# EAGLE design DigitalIO_3_3V_LevelShift (EAGLE 7.7.0)
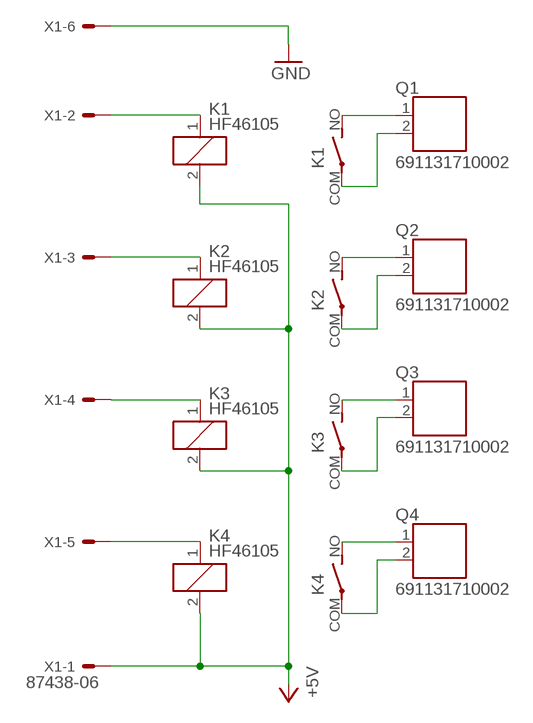
[diagram p0: schematic, sheet 1]

## Parts
K1  HF46105  [HF46]
K2  HF46105  [HF46]
K3  HF46105  [HF46]
K4  HF46105  [HF46]
Q1  691131710002  [691131710002]
Q2  691131710002  [691131710002]
Q3  691131710002  [691131710002]
Q4  691131710002  [691131710002]
X1  87438-06  [87438-06]

## Nets
+5V: K1.2 K2.2 K3.2 K4.2 X1.1
GND: X1.6
N$2: K2.1 X1.3
N$4: K4.1 X1.5
N$5: K1.1 X1.2
N$6: K1.NO(2:S) Q1.1
N$7: K1.COM(2:P) Q1.2
N$8: K2.NO(2:S) Q2.1
N$9: K2.COM(2:P) Q2.2
N$10: K3.NO(2:S) Q3.1
N$11: K3.COM(2:P) Q3.2
N$12: K4.NO(2:S) Q4.1
N$13: K4.COM(2:P) Q4.2
N$14: K3.1 X1.4

## Library data of the parts
K1-K4 = hongfa:HF46?*: Slim Power Relay NAiS Source: http://www.hongfa.com/pro/pdf/HF46F_en.pdf; OC_FARNELL: unknown; OC_NEWARK: unknown
Q1-Q4 = con-wuerth:691131710002: WR-TBL Terminal block - CUU5/2 CUU5/2GR - 2 Pins;=>Code : Con_TBL_Screw_PClamp_5.00_6911317100xx_691131710002 <http://katalog.we-online.de/media/images/eican/Con_TBL_Screw_PClamp_5.00_6911317100xx_pf2.jpg> Details see: http://katalog.we-online.de/em/datasheet/6911317100xx.pdf Created 11/23/2014, Karrer Zheng 2014 (C) Wurth Elektronik
X1 = con-molex:87438-06: Wire-to-Board 1.50mm (.059") Pitch Header - Right Angle, SMT, Shrouded Source: http://www.molex.com/product/micro/87438.html; MPN: 87438-0643; OC_FARNELL: 1756938; OC_NEWARK: 88K3155

## Board
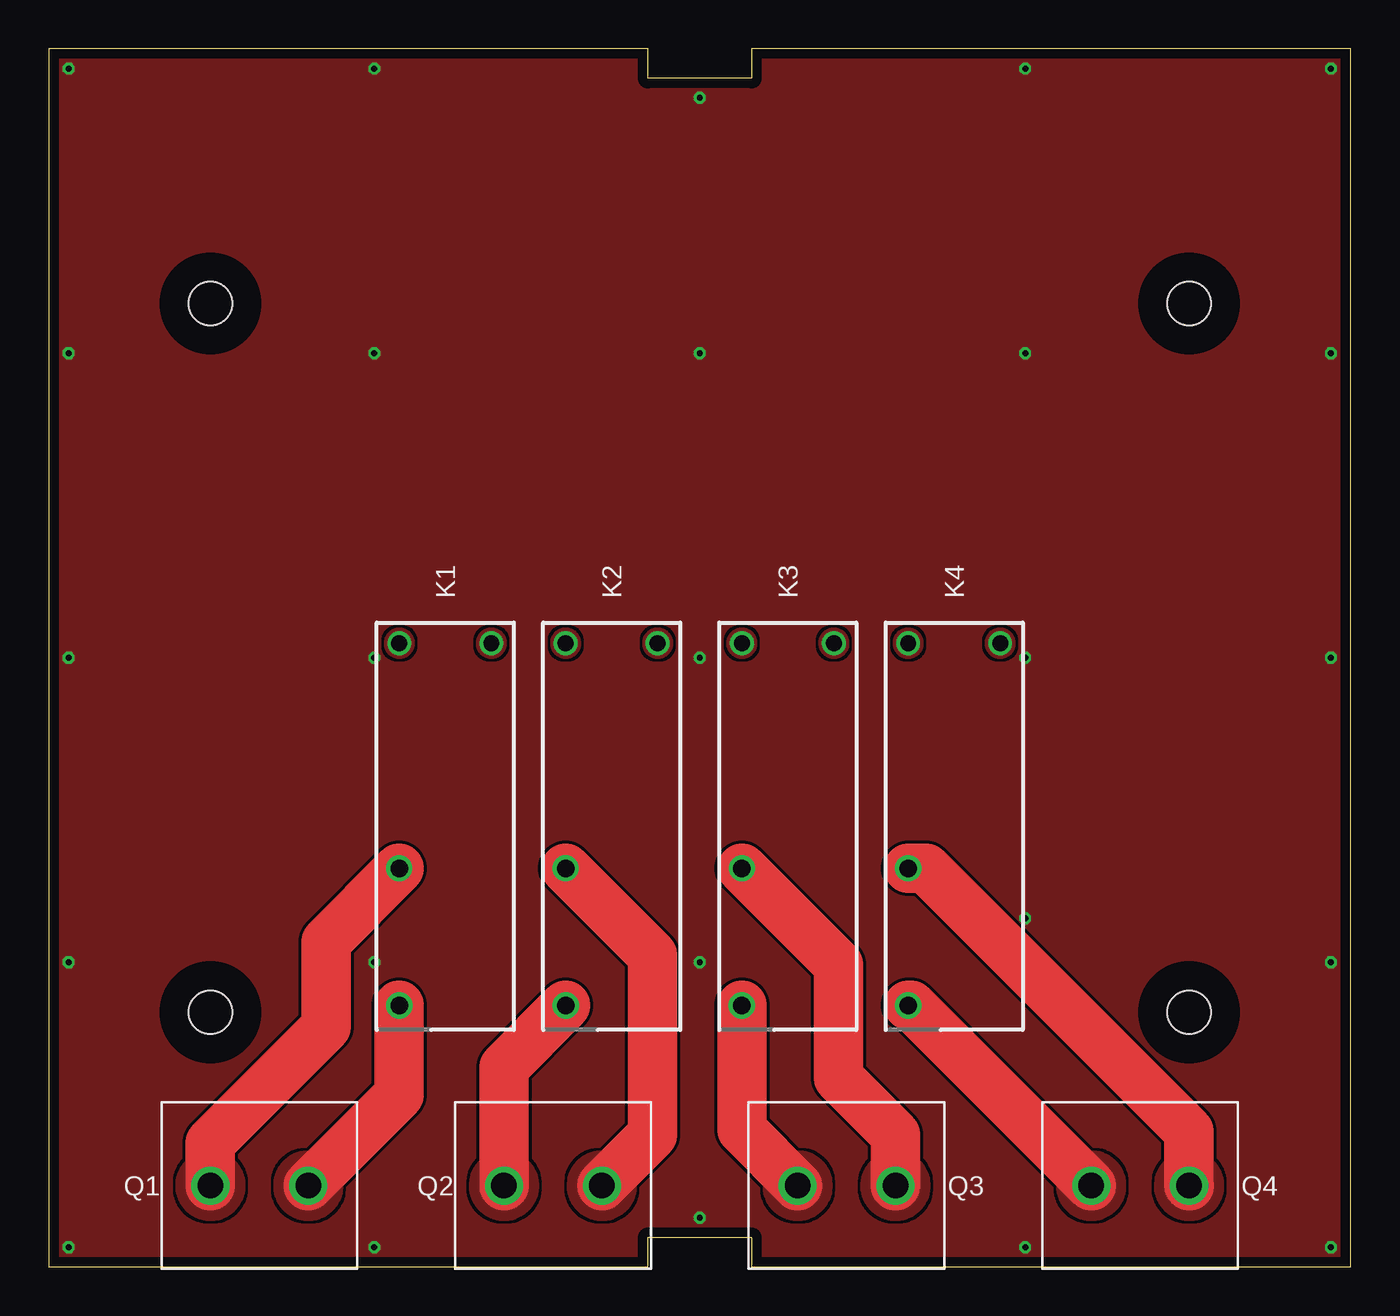
[diagram p1: board, top side]
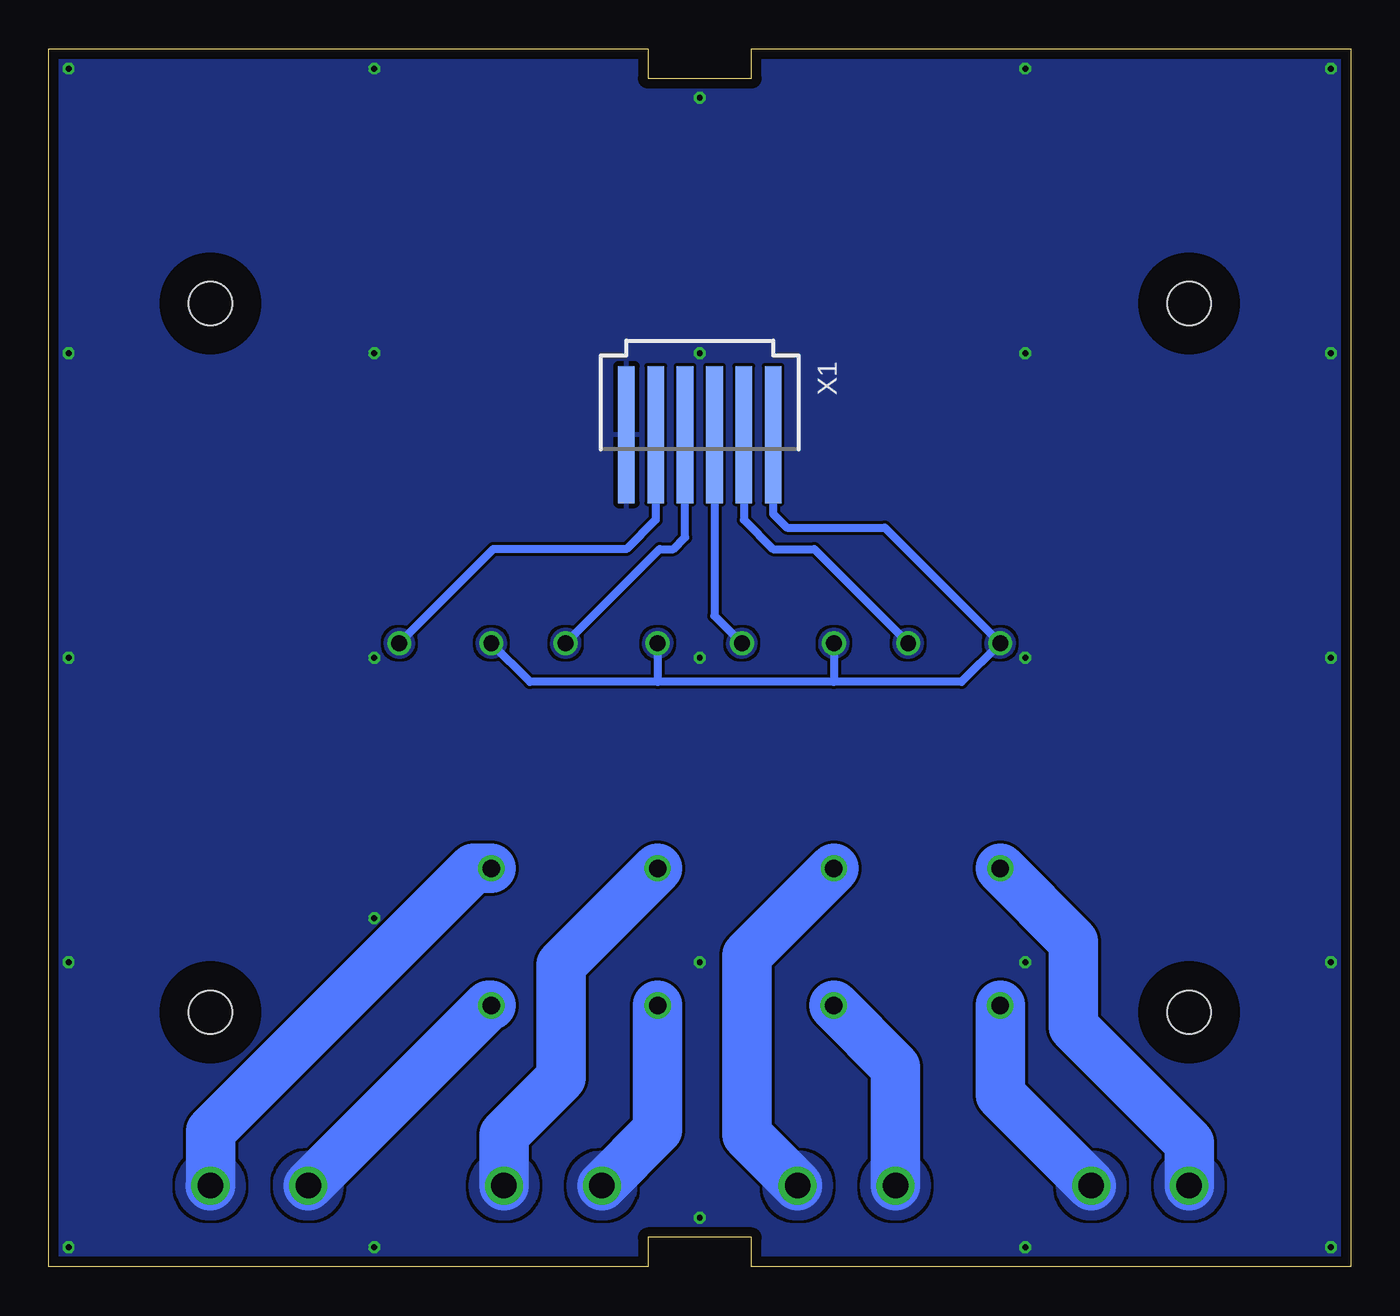
[diagram p2: board, bottom side, seen from below]

Size 66.5 x 62.2 mm. Coordinates in mm from the lower left corner, seen from the top.
Outline: 0,0 30.6,0 30.6,1.5 35.9,1.5 35.9,0 66.5,0 66.5,62.2 35.9,62.2 35.9,60.7 30.6,60.7 30.6,62.2 0,62.2 0,0
Copper layers (1*16): Top 0.035mm / dielectric 1.6mm / Bottom 0.035mm
Design rules "Elecrow *": minimum track width 6mil, minimum drill 12mil, track to track 6mil, track to pad 6mil, pad to pad 6mil, via to via 8mil, smd to smd 0mil, copper to edge 20mil, drill to drill 10mil, minimum pad ring 6mil, minimum via ring 6mil, stop-mask expansion 0mil, vias tented up to drill 100mil, thermal gap 10mil
Holes 2.2 mm at 8.25,49.2 58.25,13 8.25,13 58.25,49.2
tRestrict: area 5.7,10.4 to 10.8,15.6; area 55.6,10.4 to 60.9,15.6; area 55.6,46.6 to 60.9,51.8; area 5.7,46.6 to 10.8,51.8
bRestrict: area 5.7,10.4 to 10.8,15.6; area 55.6,10.4 to 60.9,15.6; area 55.6,46.6 to 60.9,51.8; area 5.7,46.6 to 10.8,51.8

### Footprints (pad centres in the part's own frame; a part is rotated, then mirrored left to right if it is on the bottom)
HF46 = drill 0.813: 1 -9.35,2.35; 2 -9.35,-2.35 | drill 0.889: COM 2.15,-2.35 | drill 0.9: NO 9.15,-2.35
691131710002 = drill 1.3: 1 -2.5,0; 2 2.5,0
87438-06 = smd 7 x 0.85: 1 0,3.75; 2 0,2.25; 3 0,0.75; 4 0,-0.75; 5 0,-2.25; 6 0,-3.75

### Placement (x,y rotation side)
K1  20.25,22.5 270 top
K2  28.75,22.5 270 top
K3  37.75,22.5 270 top
K4  46.25,22.5 270 top
Q1  10.75,4.15 180 top
Q2  25.75,4.15 0 top
Q3  40.75,4.15 0 top
Q4  55.75,4.15 0 top
X1  33.25,42.5 270 bottom

### Tracks (layer width: path | path; a pad name or v marks a point on that pad's centre or on a via)
+5V
  Bottom 0.406: 26.4,29.88 19.87,29.88 K1.2 23.8,37.75 28.8,37.75 29.5,38.45 X1.1 | 26.4,29.88 35.4,29.88 | 35.4,29.88 41.93,29.88 K4.2 | K3.2 35.4,29.88 | K2.2 26.4,29.88
  pour Bottom (no thermals): 18.38,31.38 arc180 17.42,32.32 arc180
  pour Top (no thermals): 18.38,31.38 arc180 17.42,32.32 arc180
  pour Top (no thermals): 26.88,31.38 arc180 25.92,32.32 arc180
  pour Bottom (no thermals): 26.88,31.38 arc180 25.92,32.32 arc180
  pour Bottom (no thermals): 35.88,31.38 arc180 34.92,32.32 arc180
  pour Top (no thermals): 35.88,31.38 arc180 34.92,32.32 arc180
  pour Top (no thermals): 44.38,32.32 arc180 43.42,31.38 arc180
  pour Bottom (no thermals): 44.38,32.32 arc180 43.42,31.38 arc180
GND  (via drill 0.3)
  other vias: 1,1 1,61.2 1,46.65 1,31.1 1,15.55 16.62,61.2 16.62,46.65 16.62,31.1 16.62,15.55 16.62,1 33.25,59.7 33.25,46.65 33.25,31.1 33.25,15.55 33.25,2.5 49.88,61.2 49.88,46.65 49.88,31.1 49.88,17.8 49.88,1 65.5,61.2 65.5,46.65 65.5,31.1 65.5,15.55 65.5,1
  pour Top (rank 2): 0,62.2 30.6,62.2 30.6,60.7 35.9,60.7 35.9,62.2 66.5,62.2 66.5,0 35.9,0 35.9,1.5 30.6,1.5 30.6,0 0,0
  pour Bottom (rank 2): 0,62.2 30.6,62.2 30.6,60.7 35.9,60.7 35.9,62.2 66.5,62.2 66.5,0 35.9,0 35.9,1.5 30.6,1.5 30.6,0 0,0
N$2
  Bottom 0.406: X1.3 32.5,33.25 K2.1
  pour Top (no thermals): 31.58,31.38 arc180 30.62,32.32 arc180
  pour Bottom (no thermals): 31.58,31.38 arc180 30.62,32.32 arc180
N$4
  Bottom 0.406: X1.5 35.5,38.15 37,36.65 43.8,36.65 K4.1
  pour Top (no thermals): 49.08,32.32 arc180 48.12,31.38 arc180
  pour Bottom (no thermals): 49.08,32.32 arc180 48.12,31.38 arc180
N$5
  Bottom 0.406: X1.2 31,38.15 29.5,36.65 27.4,36.65 K1.1
  pour Top (no thermals): 23.08,31.38 arc180 22.12,32.32 arc180
  pour Bottom (no thermals): 23.08,31.38 arc180 22.12,32.32 arc180
N$6
  Top 2.54: K1.NO 17.9,8.8 Q1.1
  Bottom 2.54: K1.NO 17.9,8.8 Q1.1
  pour Top (no thermals): 14.35,5.35 arc180 12.15,2.95 arc180
  pour Bottom (no thermals): 14.35,5.35 arc180 12.15,2.95 arc180
N$7
  Top 2.54: Q1.2 8.25,6.34 14.16,12.25 14.16,16.61 K1.COM
  Bottom 2.54: K1.COM 14.16,16.61 14.16,12.25 8.25,6.34 Q1.2
  pour Top (no thermals): 9.35,5.35 arc180 7.15,2.95 arc180
  pour Bottom (no thermals): 9.35,5.35 arc180 7.15,2.95 arc180
N$8
  Top 2.54: K2.NO 23.25,10.2 Q2.1
  Bottom 2.54: K2.NO 23.25,10.2 Q2.1
  pour Top (no thermals): 24.35,5.35 arc180 22.15,2.95 arc180
  pour Bottom (no thermals): 24.35,5.35 arc180 22.15,2.95 arc180
N$9
  Top 2.54: Q2.2 | Q2.2 30.84,6.75 30.84,15.91 K2.COM
  Bottom 2.54: Q2.2 30.84,6.75 30.84,15.91 K2.COM
  pour Top (no thermals): 29.35,5.35 arc180 27.15,2.95 arc180
  pour Bottom (no thermals): 29.35,5.35 arc180 27.15,2.95 arc180
N$10
  Top 2.54: K3.NO 35.4,7 Q3.1
  Bottom 2.54: K3.NO 35.4,7 Q3.1
  pour Top (no thermals): 39.35,5.35 arc180 37.15,2.95 arc180
  pour Bottom (no thermals): 39.35,5.35 arc180 37.15,2.95 arc180
N$11
  Top 2.54: Q3.2 43.25,6.75 40.33,9.67 40.33,15.42 K3.COM
  Bottom 2.54: Q3.2 43.25,6.75 40.33,9.67 40.33,15.42 K3.COM
  pour Top (no thermals): 44.35,5.35 arc180 42.15,2.95 arc180
  pour Bottom (no thermals): 44.35,5.35 arc180 42.15,2.95 arc180
N$12
  Top 2.54: K4.NO 44.05,13.35 Q4.1
  Bottom 2.54: K4.NO 44.05,13.35 Q4.1
  pour Top (no thermals): 54.35,5.35 arc180 52.15,2.95 arc180
  pour Bottom (no thermals): 54.35,5.35 arc180 52.15,2.95 arc180
N$13
  Top 2.54: K4.COM 44.81,20.35 58.23,6.93 58.23,4.17 Q4.2
  Bottom 2.54: K4.COM 44.81,20.35 58.23,6.93 58.23,4.17 Q4.2
  pour Top (no thermals): 59.35,5.35 arc180 57.15,2.95 arc180
  pour Bottom (no thermals): 59.35,5.35 arc180 57.15,2.95 arc180
N$14
  Bottom 0.254: K3.1 39.62,31.85
  Bottom 0.406: K3.1 35.3,36.65 34.6,36.65 34,37.25 X1.4
  pour Top (no thermals): 40.58,31.38 arc180 39.62,32.32 arc180
  pour Bottom (no thermals): 40.58,31.38 arc180 39.62,32.32 arc180

### Text on the board
bDocu: 8DI/8DO